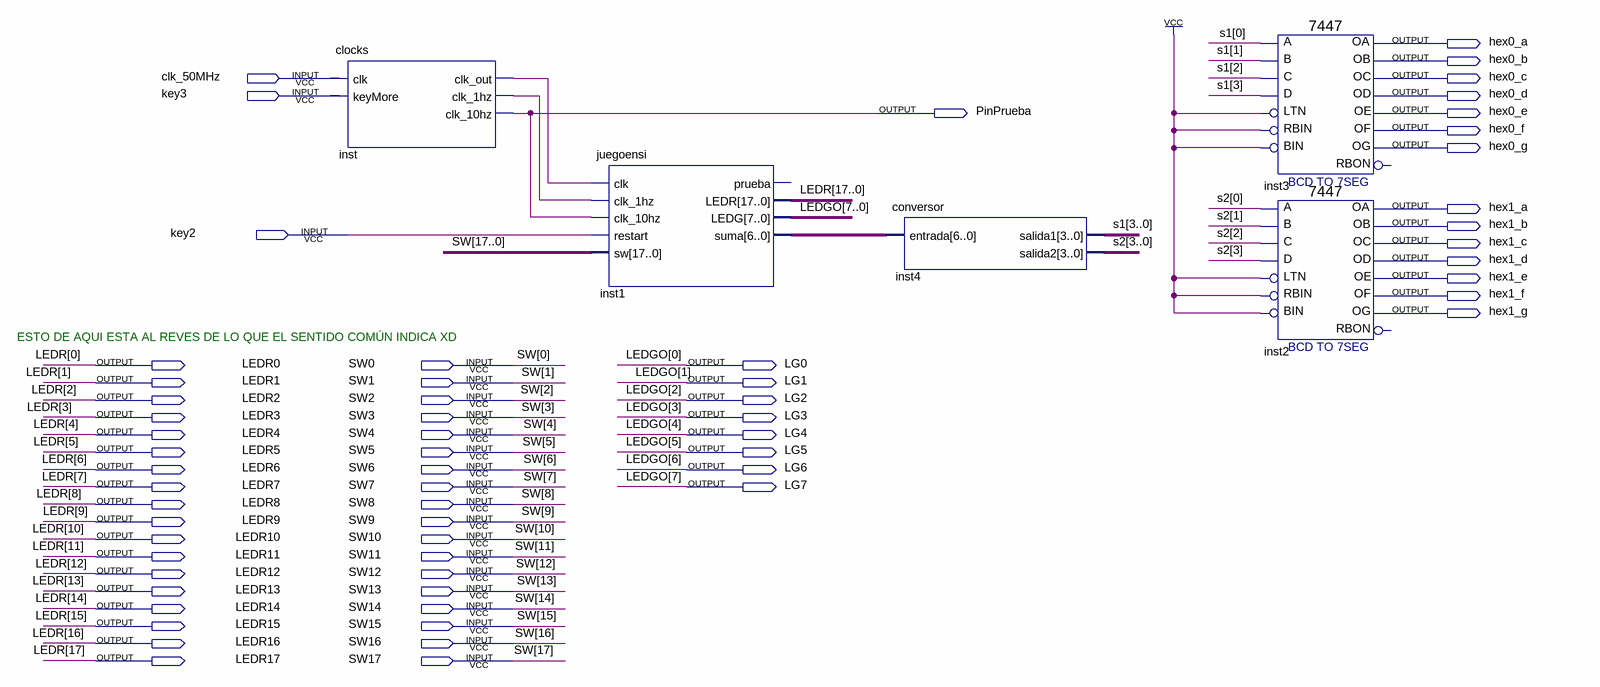
[diagram p0: schematic sheet]
// Quartus schematic gatoyraton.bdf as structural Verilog: 5 symbols, 62 pins
module gatoyraton (
  input  clk_50MHz,
  input  key3,
  input  key2,
  input  SW0,
  input  SW1,
  input  SW2,
  input  SW3,
  input  SW4,
  input  SW5,
  input  SW6,
  input  SW7,
  input  SW8,
  input  SW9,
  input  SW10,
  input  SW11,
  input  SW12,
  input  SW13,
  input  SW14,
  input  SW15,
  input  SW16,
  input  SW17,
  output hex0_a,
  output hex0_b,
  output hex0_c,
  output hex0_d,
  output PinPrueba,
  output hex0_e,
  output hex0_f,
  output hex0_g,
  output hex1_a,
  output hex1_b,
  output hex1_c,
  output hex1_d,
  output hex1_e,
  output hex1_f,
  output hex1_g,
  output LEDR0,
  output LG0,
  output LEDR1,
  output LG1,
  output LEDR2,
  output LG2,
  output LEDR3,
  output LG3,
  output LEDR4,
  output LG4,
  output LEDR5,
  output LG5,
  output LEDR6,
  output LG6,
  output LEDR7,
  output LG7,
  output LEDR8,
  output LEDR9,
  output LEDR10,
  output LEDR11,
  output LEDR12,
  output LEDR13,
  output LEDR14,
  output LEDR15,
  output LEDR16,
  output LEDR17
);

  wire inst_clk_1hz, inst_clk_out;
  wire [3:0] s1, s2;
  wire [6:0] inst1_suma;

  clocks inst (.clk(clk_50MHz), .keyMore(key3), .clk_out(inst_clk_out), .clk_1hz(inst_clk_1hz), .clk_10hz(PinPrueba));
  juegoensi inst1 (
    .clk(inst_clk_out), .clk_1hz(inst_clk_1hz), .clk_10hz(PinPrueba), .restart(key2),
    .sw({SW17, SW16, SW15, SW14, SW13, SW12, SW11, SW10, SW9, SW8, SW7, SW6, SW5, SW4, SW3, SW2, SW1, SW0}),
    .LEDR({LEDR17, LEDR16, LEDR15, LEDR14, LEDR13, LEDR12, LEDR11, LEDR10, LEDR9, LEDR8, LEDR7, LEDR6, LEDR5, LEDR4, LEDR3, LEDR2, LEDR1, LEDR0}),
    .LEDG({LG7, LG6, LG5, LG4, LG3, LG2, LG1, LG0}), .suma(inst1_suma));  // open: prueba
  conversor inst4 (.entrada(inst1_suma), .salida1(s1), .salida2(s2));
  \7447  inst3 (
    .LTN(1'b1), .B(s1[1]), .C(s1[2]), .D(s1[3]), .RBIN(1'b1), .BIN(1'b1), .A(s1[0]), .OB(hex0_b),
    .OC(hex0_c), .OE(hex0_e), .OD(hex0_d), .OF(hex0_f), .OG(hex0_g), .OA(hex0_a));  // open: RBON
  \7447  inst2 (
    .LTN(1'b1), .B(s2[1]), .C(s2[2]), .D(s2[3]), .RBIN(1'b1), .BIN(1'b1), .A(s2[0]), .OB(hex1_b),
    .OC(hex1_c), .OE(hex1_e), .OD(hex1_d), .OF(hex1_f), .OG(hex1_g), .OA(hex1_a));  // open: RBON

  // Other names for the same wires on the sheet: LEDGO[7:0] = {LG7, LG6, LG5, LG4, LG3, LG2, LG1, LG0}

  // Notes on the sheet:
  //   ESTO DE AQUI ESTA AL REVES DE LO QUE EL SENTIDO COMÚN INDICA XD
endmodule
